# Altium schematic sheet StEth32_Base_XLR_Output.SchDoc
size A4
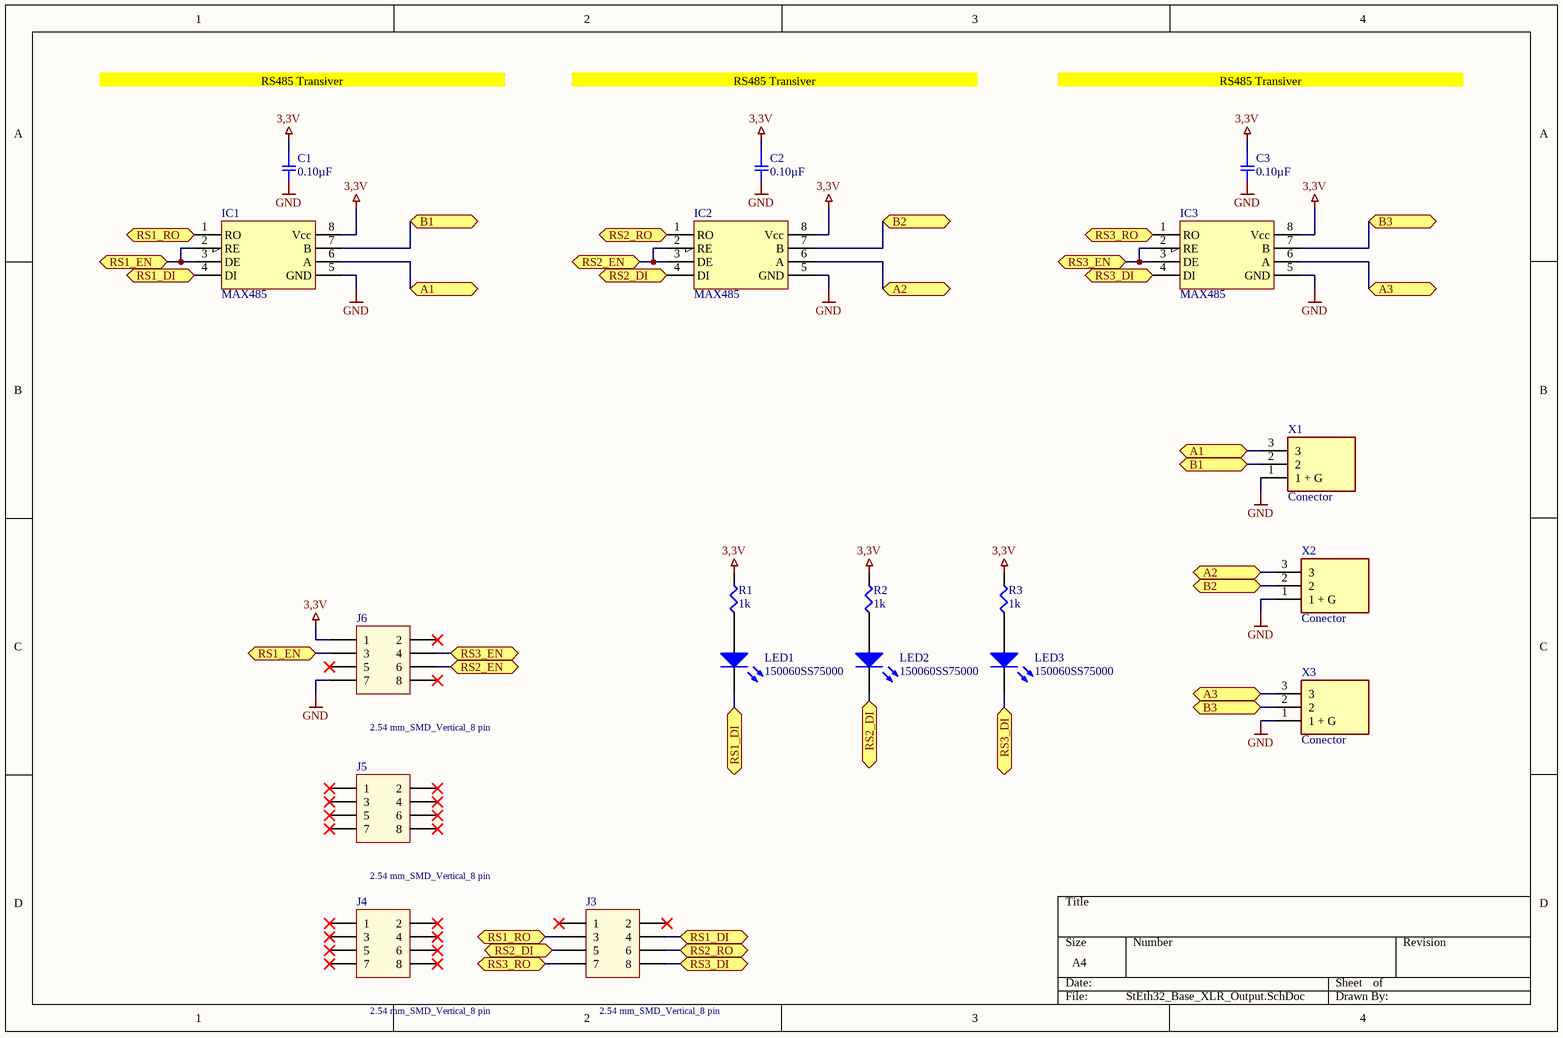
[diagram p0: StEth32_Base_XLR_Output.SchDoc]

## Parts
C1  0.10µF  [SMD-0603C]
C2  0.10µF  [SMD-0603C]
C3  0.10µF  [SMD-0603C]
IC1  MAX485  [D008_L]
IC2  MAX485  [D008_L]
IC3  MAX485  [D008_L]
J3  2.54 mm_SMD_Vertical_8 pin  [61030821121]
J4  2.54 mm_SMD_Vertical_8 pin  [61030821121]
J5  2.54 mm_SMD_Vertical_8 pin  [61030821121]
J6  2.54 mm_SMD_Vertical_8 pin  [61030821121]
LED1  150060SS75000  [0603_A]
LED2  150060SS75000  [0603_A]
LED3  150060SS75000  [0603_A]
R1  1k  [SMD-0603-RES]
R2  1k  [SMD-0603-RES]
R3  1k  [SMD-0603-RES]
X1  Conector  [NC3FAAV1]
X2  Conector  [NC3FAAV1]
X3  Conector  [NC3FAAV1]

## Ports
A1 (bidir), A2 (bidir), A3 (bidir), B1 (bidir), B2 (bidir), B3 (bidir), RS1_DI (bidir), RS1_EN (bidir), RS1_RO (bidir), RS2_DI (bidir), RS2_EN (bidir), RS2_RO (bidir), RS3_DI (bidir), RS3_EN (bidir), RS3_RO (bidir)

## Nets
3,3V: C1.1 C2.1 C3.1 IC1.8(Vcc) IC2.8(Vcc) IC3.8(Vcc) J6.1 R1.2 R2.2 R3.2
GND: C1.2 C2.2 C3.2 IC1.5(GND) IC2.5(GND) IC3.5(GND) J6.7 X1.1(1_+_G) X2.1(1_+_G) X3.1(1_+_G)
A1: IC1.6(A) X1.3 ; port A1
A2: IC2.6(A) X2.3 ; port A2
A3: IC3.6(A) X3.3 ; port A3
B1: IC1.7(B) X1.2 ; port B1
B2: IC2.7(B) X2.2 ; port B2
B3: IC3.7(B) X3.2 ; port B3
RS1_DI: IC1.4(DI) J3.4 LED1.1(K) ; port RS1_DI
RS1_EN: IC1.2(RE) IC1.3(DE) J6.3 ; port RS1_EN
RS1_RO: IC1.1(RO) J3.3 ; port RS1_RO
RS2_DI: IC2.4(DI) J3.5 LED2.1(K) ; port RS2_DI
RS2_EN: IC2.2(RE) IC2.3(DE) J6.6 ; port RS2_EN
RS2_RO: IC2.1(RO) J3.6 ; port RS2_RO
RS3_DI: IC3.4(DI) J3.8 LED3.1(K) ; port RS3_DI
RS3_EN: IC3.2(RE) IC3.3(DE) J6.4 ; port RS3_EN
RS3_RO: IC3.1(RO) J3.7 ; port RS3_RO
NetLED1_2: LED1.2(A) R1.1
NetLED2_2: LED2.2(A) R2.1
NetLED3_2: LED3.2(A) R3.1

Not connected (* = marked no-connect by the designer): J3 1* 2*; J4 1* 2* 3* 4* 5* 6* 7* 8*; J5 1* 2* 3* 4* 5* 6* 7* 8*; J6 2* 5* 8*

## Notes on the sheet
- RS485 Transiver

## Library data of the parts
C1-C3 = GCM188R71C104KA37J: CAP CER 0.1UF 16V X7R 0603; Manufacturer: Murata Electronics North America; Factory Stock: 0; Unit Price (USD): 0.18; Minimum Quantity: 1; Tolerance: ±10%; Datasheets: http://www.murata.com/~/media/webrenewal/support/library/catalog/products/capacitor/mlcc/c03e.ashx; Image: //media.digikey.com/Renders/Murata%20Renders/0603%28GCM188%29.jpg; Digi-Key Part Number: 490-8015-1-ND; Part Number: GCM188R71C104KA37J; Quantity Available: 17844; @ qty: 0; Packaging: Cut Tape (CT); Series: GCM; Part Status: Active; Value: 0.10µF; Voltage: 16V; Temperature Coefficient: X7R; Operating Temperature: -55°C ~ 125°C; Features: -; Ratings: AEC-Q200; Applications: Automotive; Mounting Type: Surface Mount, MLCC; Package / Case: 0603 (1608 Metric); Size / Dimension: 0.063" L x 0.031" W (1.60mm x 0.80mm); Height - Seated (Max): -; Thickness (Max): 0.035" (0.90mm); Lead Spacing: -; Lead Style: -
J3-J6 = 61030821121: Pin Header WR-PHD, pitch 2.54 mm, SMD, Vertical, dual row, 8 pin; Rated Current: 3 A; Pin Number: 8; Pitch: 2.54 mm; Working Voltage: 250 VAC; Contact Resistance: 20 mOhm; Insulation Resistance: >1000 MOhm; ComponentLink1Description: Manufacturer; ComponentLink1URL: http://www.we-online.de; ComponentLink2Description: Datasheet; ComponentLink2URL: http://katalog.we-online.de/em/datasheet/6103xx21121.pdf; Part Number: 61030821121; Published Date: Jan. 2018; Publisher: Wurth Elektronik; Operating Temperature: -40 to 125 degC; Mounting Technology: SMD; Row Number: Dual; Orientation: Vertical
LED1-LED3 = 150060SS75000: SMD mono-color Chip LED, WL-SMCW, Super Red; PackageReference: 0603_A; Color: Super Red; PartNumber: 150060SS75000; ComponentLink1Description: Manufacturer URL; ComponentLink1URL: http://www.we-online.com; ComponentLink2Description: Datasheet; ComponentLink2URL: http://katalog.we-online.com/led/datasheet/150060SS75000.pdf
R1-R3 = ERJ-PA3F1001V: RES SMD 1K OHM 1% 1/4W 0603; Manufacturer: Panasonic Electronic Components; Factory Stock: 0; Unit Price (USD): 0.02372; @ qty: 1500; Minimum Quantity: 1; Power (Watts): 0.25W, 1/4W; Temperature Coefficient: ±100ppm/°C; Part Number: ERJ-PA3F1001V; Datasheets: https://industrial.panasonic.com/cdbs/www-data/pdf/RDA0000/AOA0000C243.pdf; Image: //media.digikey.com/Photos/Panasonic%20Photos/MFG_ERJ-P6W%20Series.jpg; Digi-Key Part Number: P1.0KBYCT-ND; Quantity Available: 69166; Packaging: Cut Tape (CT); Series: ERJ; Part Status: Active; Value: 1k; Tolerance: ±1%; Composition: Thick Film; Features: Automotive AEC-Q200, Pulse Withstanding; Operating Temperature: -55°C ~ 155°C; Package / Case: 0603 (1608 Metric); Supplier Device Package: 0603; Size / Dimension: 0.063" L x 0.031" W (1.60mm x 0.80mm); Height - Seated (Max): 0.022" (0.55mm); Number of Terminations: 2; Failure Rate: -
X1-X3 = NC3FAAV1: Neutrik XLR Connector